# EAGLE design Garage Controller (EAGLE 7.1.0)
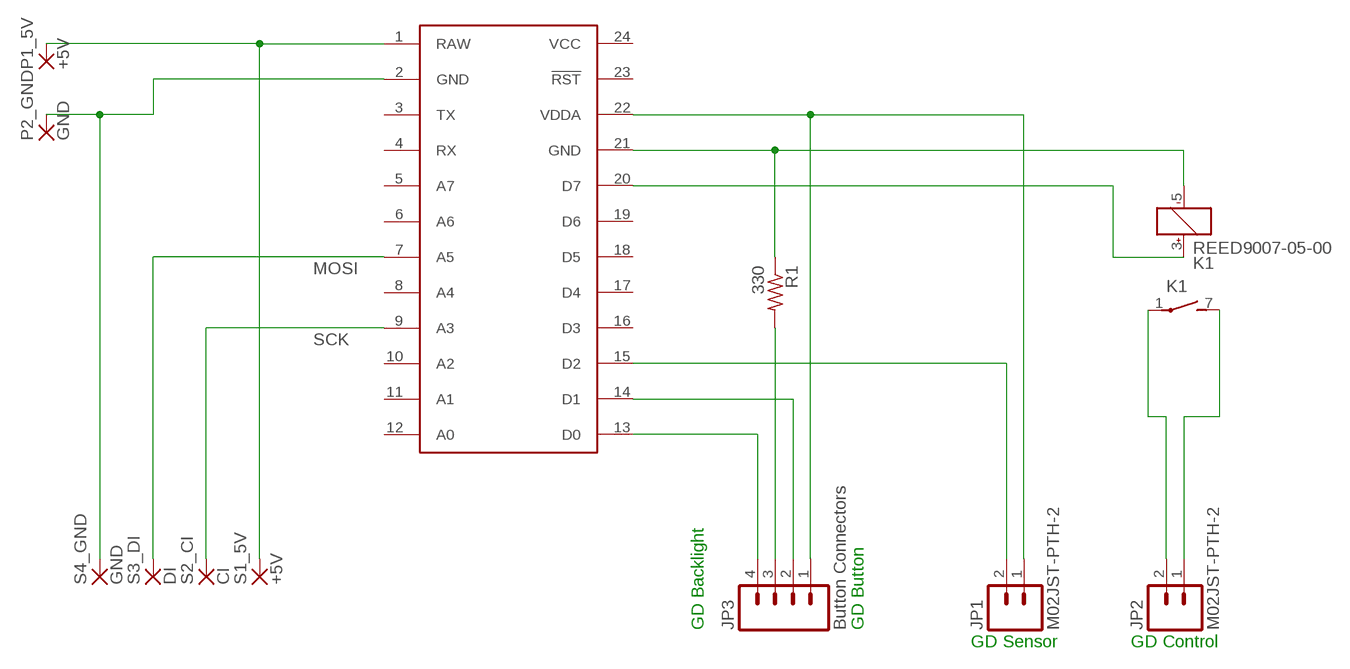
[diagram p0: schematic, sheet 1]

## Parts
CORE  SPARK_CORECORE  [SPARK_CORE]
JP1  M02JST-PTH-2  [JST-2-PTH]
JP2  M02JST-PTH-2  [JST-2-PTH]
JP3  Button Connectors  M04JST-PTH  [JST-4-PTH]
K1  REED9007-05-00  [REED]
P1_5V  +5V  1,6/0,8  [1,6/0,8]
P2_GND  GND  1,6/0,8  [1,6/0,8]
R1  330  R-US_0207/5V  [0207/5V]
S1_5V  +5V  1,6/0,8  [1,6/0,8]
S2_CI  CI  1,6/0,8  [1,6/0,8]
S3_DI  DI  1,6/0,8  [1,6/0,8]
S4_GND  GND  1,6/0,8  [1,6/0,8]

## Nets
MOSI: CORE.7(A5) S3_DI.1(P)
N$1: JP3.3 R1.2
N$2: CORE.13(D0) JP3.4
N$3: CORE.21(GND) K1.5(1:-) R1.1
N$4: CORE.22(VDDA) JP1.1 JP3.1
N$5: JP2.1 K1.7(2:S)
N$6: JP2.2 K1.1(2:P)
N$7: CORE.20(D7) K1.3(1:+)
N$8: CORE.14(D1) JP3.2
N$9: CORE.2(GND) P2_GND.1(P) S4_GND.1(P)
N$10: CORE.1(RAW) P1_5V.1(P) S1_5V.1(P)
N$11: CORE.15(D2) JP1.2
SCK: CORE.9(A3) S2_CI.1(P)
Unconnected: CORE.3(TX) CORE.4(RX) CORE.5(A7) CORE.6(A6) CORE.8(A4) CORE.10(A2) CORE.11(A1) CORE.12(A0) CORE.16(D3) CORE.17(D4) CORE.18(D5) CORE.19(D6) CORE.23(!RST)

## Notes on the sheet
- GD Backlight | GD Button
- GD Sensor | GD Control

## Power pins joined to a net without a drawn wire
VCC: CORE.24(VCC)

## Library data of the parts
CORE = Spark:SPARK_CORE
JP1 JP2 = SparkFun-Connectors:M02: Standard 2-pin 0.1" header. Use with - straight break away headers ( PRT-00116) - right angle break away headers (PRT-00553) - swiss pins (PRT-00743) - machine pins (PRT-00117) - female headers (PRT-00115) Molex polarized connector foot print use with: PRT-08233 with associated crimp pins and housings. 2.54_SCREWTERM for use with PRT-10571. 3.5mm Screw Terminal footprints for PRT-08084 5mm Screw Terminal footprints for use with PRT-08432; SKU: PRT-09914
JP3 = SparkFun-Connectors:M04: Header 4 Standard 4-pin 0.1" header. Use with straight break away headers (SKU : PRT-00116), right angle break away headers (PRT-00553), swiss pins (PRT-00743), machine pins (PRT-00117), and female headers (PRT-00115). Molex polarized connector foot print use with SKU : PRT-08231 with associated crimp pins and housings. 1MM SMD Version SKU: PRT-10208; SKU: PRT-09916
K1 = relays:REED: RELAY, SPST, 5VDC, 0.5A, SIP COTO TECHNOLOGY - 9007-05-00 Výrobce: COTO TECHNOLOGY Objednací kód:1081682 Typové označení:9007-05-00 Coil Voltage VDC Nom: 5V Coil Resistance: 500ohm Switching Current Max:500mA Switching Voltage Max: 200V Contact Configuration: SPST Relay Mounting: Through Hole External Height: 7.7mm External Width: 19.3mm External Depth: 5.08mm SVHC: No SVHC (19-Dec-2012) Approval Bodies: CSA / UL Coil Voltage Max: 6.5V DC Dielectric Strength VAC: 1500V Must Actuate Voltage: 3.75V DC Must Release Voltage: 0.4V DC No. of Pins: 4 Operating Temperature Max: 85°C Operating Temperature Min: -20°C Operating Time: 0.50ms Release Time: 0.20ms Switch Power Max: 10W; MPN: 9007-05-00; OC_FARNELL: 1081682; PACKAGE: REED; SUPPLIER: Coto Technology
P1_5V P2_GND S1_5V S2_CI S3_DI S4_GND = wirepad:1,6/0,8: THROUGH-HOLE PAD
R1 = resistor:R-US_: RESISTOR, American symbol

## Board
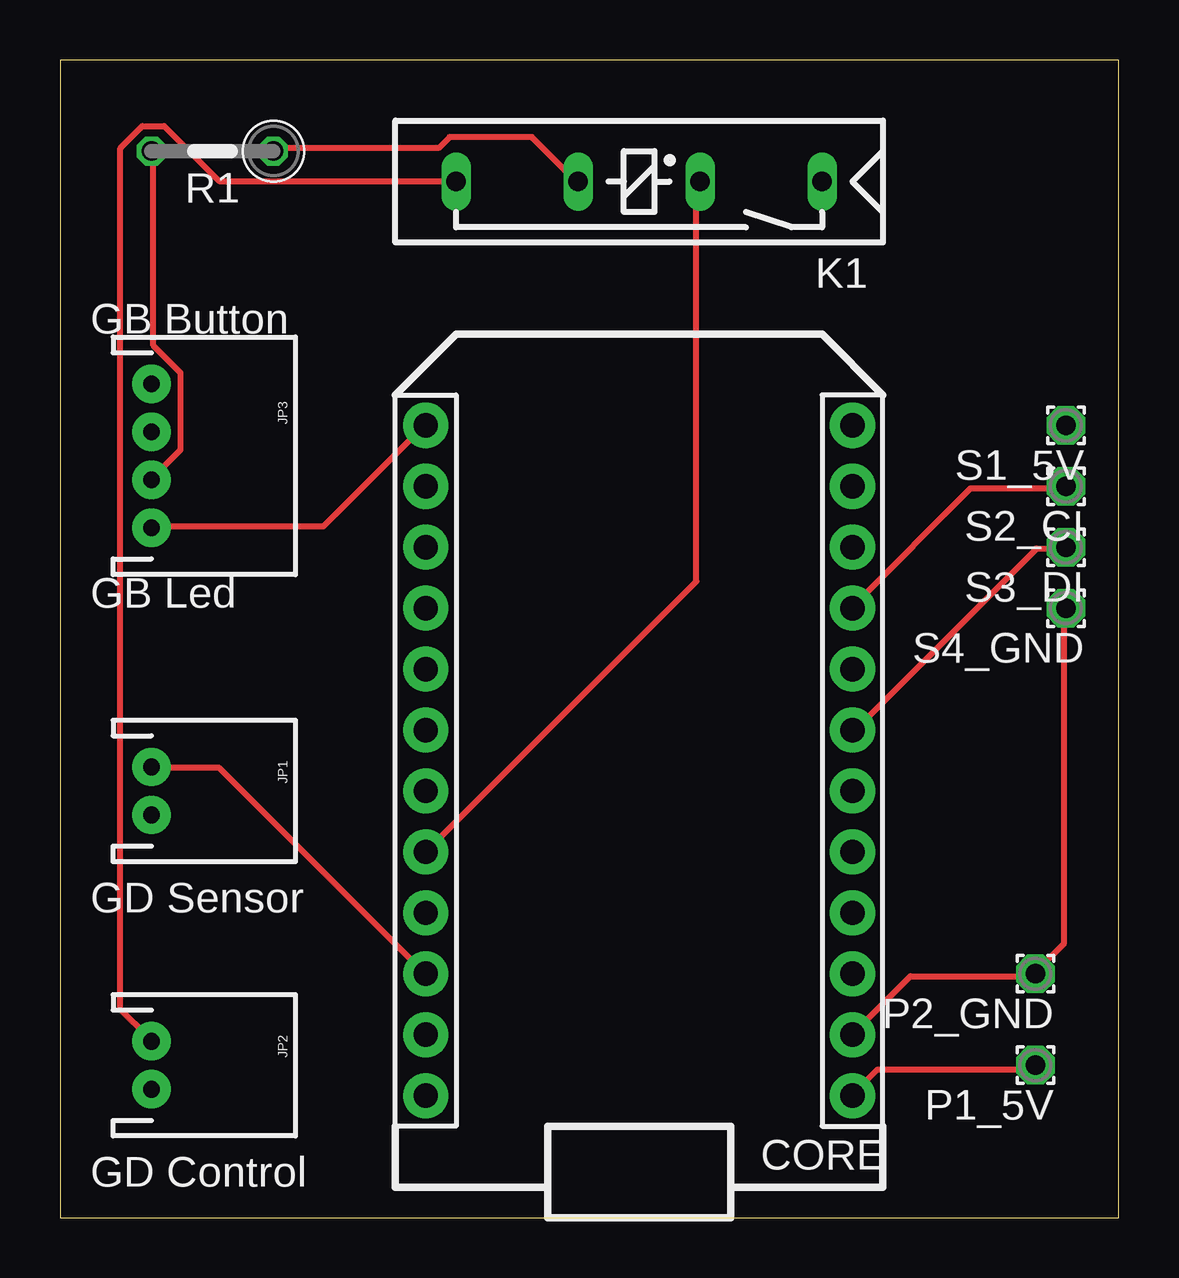
[diagram p1: board, top side]
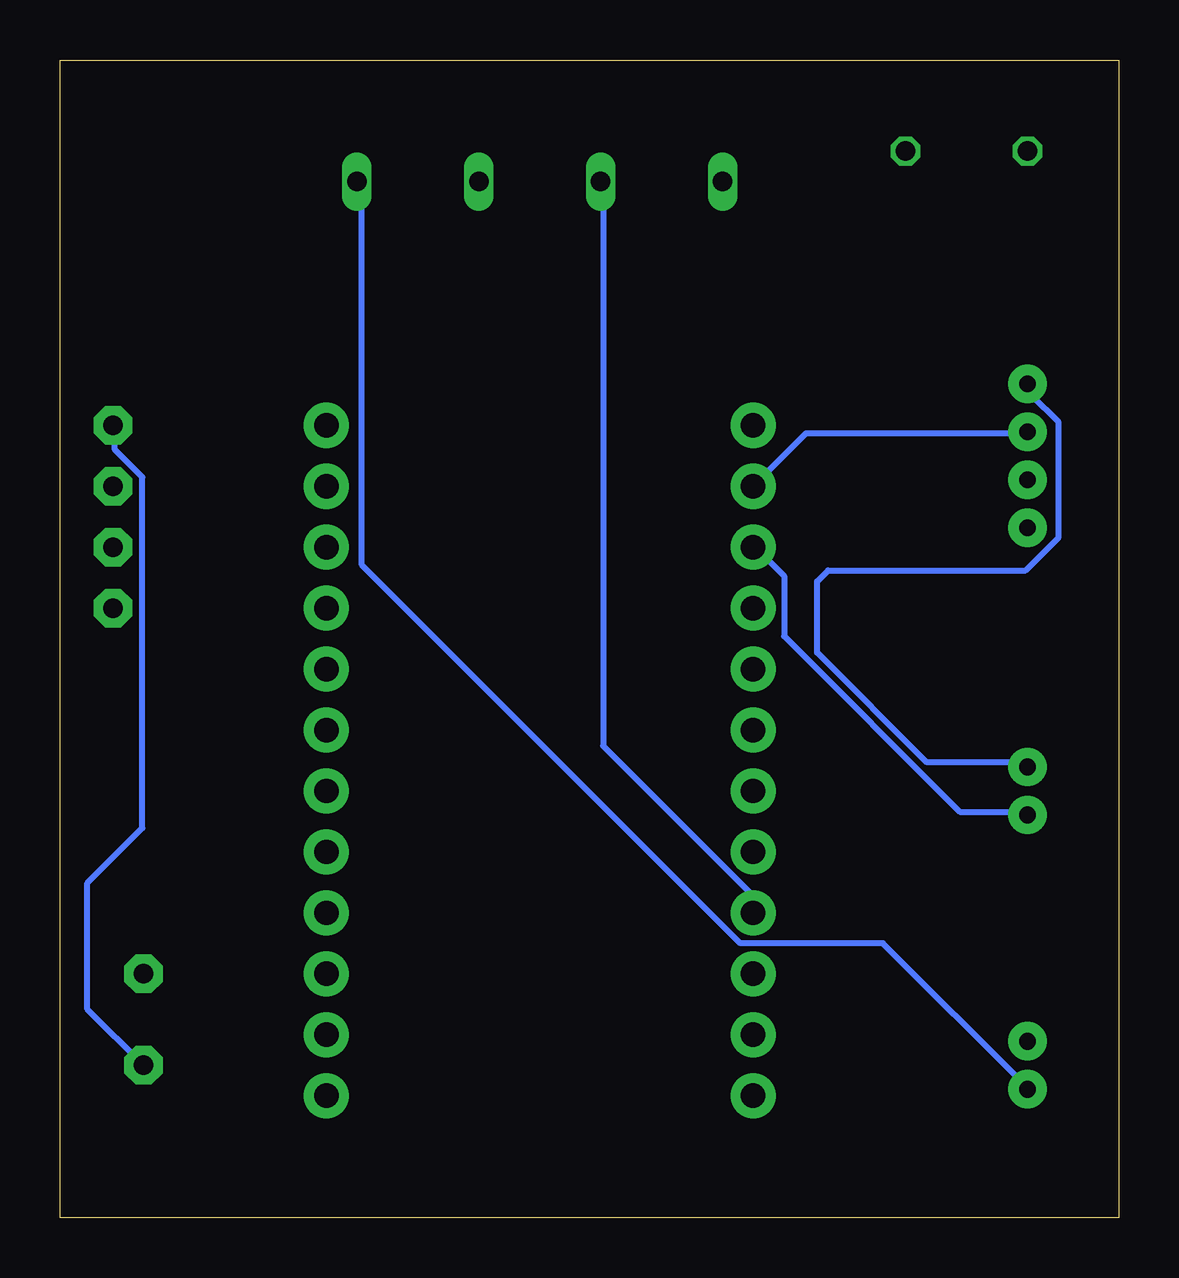
[diagram p2: board, bottom side, seen from below]

Size 44.12 x 48.25 mm. Coordinates in mm from the lower left corner, seen from the top.
Outline: 0,0 44.12,0 44.12,48.25 0,48.25 0,0
Copper layers (1*16): Top 0.0356mm / dielectric 1.5011mm / Bottom 0.0356mm
Design rules "LaenPCBOrder": minimum track width 6mil, minimum drill 13mil, track to track 6mil, track to pad 6mil, pad to pad 6mil, via to via 6mil, smd to smd 6mil, copper to edge 15mil, drill to drill 6mil, minimum pad ring 7mil, minimum via ring 7mil, stop-mask expansion 3mil, vias tented up to drill 0mil, thermal gap 10mil

### Footprints (pad centres in the part's own frame; a part is rotated, then mirrored left to right if it is on the bottom)
SPARK_CORE = drill 1.016 pad 1.88: 1 -8.89,13.97; 2 -8.89,11.43; 3 -8.89,8.89; 4 -8.89,6.35; 5 -8.89,3.81; 6 -8.89,1.27; 7 -8.89,-1.27; 8 -8.89,-3.81; 9 -8.89,-6.35; 10 -8.89,-8.89; 11 -8.89,-11.43; 12 -8.89,-13.97; 13 8.89,-13.97; 14 8.89,-11.43; 15 8.89,-8.89; 16 8.89,-6.35; 17 8.89,-3.81; 18 8.89,-1.27; 19 8.89,1.27; 20 8.89,3.81; 21 8.89,6.35; 22 8.89,8.89; 23 8.89,11.43; 24 8.89,13.97
JST-2-PTH = drill 0.7 pad 1.6: 1 -1,0; 2 1,0
JST-4-PTH = drill 0.7 pad 1.6: 1 -3,0; 2 -1,0; 3 1,0; 4 3,0
REED = drill 0.813 long: 1 -17.78,2.54; 3 -12.7,2.54; 5 -7.62,2.54; 7 -2.54,2.54
1,6/0,8 = drill 0.813 pad 1.6 octagon: 1 0,0
0207/5V = drill 0.813 octagon: 1 -2.54,0; 2 2.54,0

### Placement (x,y rotation side)
CORE  24.13,19.05 180 top
JP1  3.81,17.78 270 top
JP2  3.81,6.35 270 top
JP3  3.81,31.75 270 top
K1  13.97,45.72 180 top
P1_5V  40.64,6.35 180 top
P2_GND  40.64,10.16 180 top
R1  6.35,44.45 180 top
S1_5V  41.91,33.02 180 top
S2_CI  41.91,30.48 180 top
S3_DI  41.91,27.94 180 top
S4_GND  41.91,25.4 180 top

### Tracks (layer width: path | path; a pad name or v marks a point on that pad's centre or on a via)
MOSI
  Top 0.254: S3_DI.1 41.83,27.89 40.69,27.89 33.15,20.34 CORE.7
N$1
  Top 0.254: R1.2 3.89,44.35 3.89,36.35 5.03,35.2 5.03,32 3.89,30.86 JP3.3
N$2
  Top 0.254: JP3.4 3.89,28.8 10.97,28.8 15.09,32.92 CORE.13
N$3
  Top 0.254: R1.1 8.91,44.58 15.77,44.58 16.23,45.03 19.66,45.03 21.49,43.2 K1.5
  Bottom 0.254: CORE.21 15.32,12.8 15.32,13.49 21.49,19.66 21.49,42.98 K1.5
N$4
  Top 0.254: JP1.1 3.89,18.75 6.63,18.75 15.09,10.29 CORE.22
  Bottom 0.254: JP3.1 3.66,34.75 3.66,34.29 2.52,33.15 2.52,28.35 3.89,26.98 12.12,26.98 12.57,26.52 12.57,23.55 8,18.97 3.89,18.97 JP1.1
N$5
  Top 0.254: K1.7 16.46,43.2 6.63,43.2 4.34,45.49 3.43,45.49 2.52,44.58 2.52,8.69 3.66,7.54 JP2.1
N$6
  Bottom 0.254: K1.1 31.55,42.98 31.55,27.2 15.77,11.43 9.83,11.43 3.89,5.49 JP2.2
N$7
  Top 0.254: CORE.20 26.52,26.52 26.52,42.98 K1.3
N$8
  Bottom 0.254: CORE.14 13.03,32.69 3.89,32.69 JP3.2
N$9
  Top 0.254: CORE.2 33.15,7.77 35.43,10.06 40.46,10.06 P2_GND.1 40.69,10.29 41.83,11.43 41.83,25.38 S4_GND.1
N$10
  Top 0.254: P1_5V.1 40.46,6.17 34.06,6.17 33.15,5.26 CORE.1
  Bottom 0.254: P1_5V.1 42.98,8.69 42.98,13.95 40.69,16.23 40.69,30.86 41.83,32 41.83,32.92 S1_5V.1
N$11
  Bottom 0.254: JP1.2 3.89,16.92 6.63,16.92 13.95,24.23 13.95,26.75 15.09,27.89 CORE.15
SCK
  Top 0.254: S2_CI.1 41.83,30.4 37.95,30.4 33.15,25.6 CORE.9

### Text on the board
_tsilk: GB Button | GB Led | GD Sensor | GD Control